# EasyEDA schematic Pendu_LED_Arrow.json
TITLE: Sheet_1; REV: 1.0; Date: 2024-11-20; Sheet: 1/1; Drawn By: AmirB; Company: Your Company
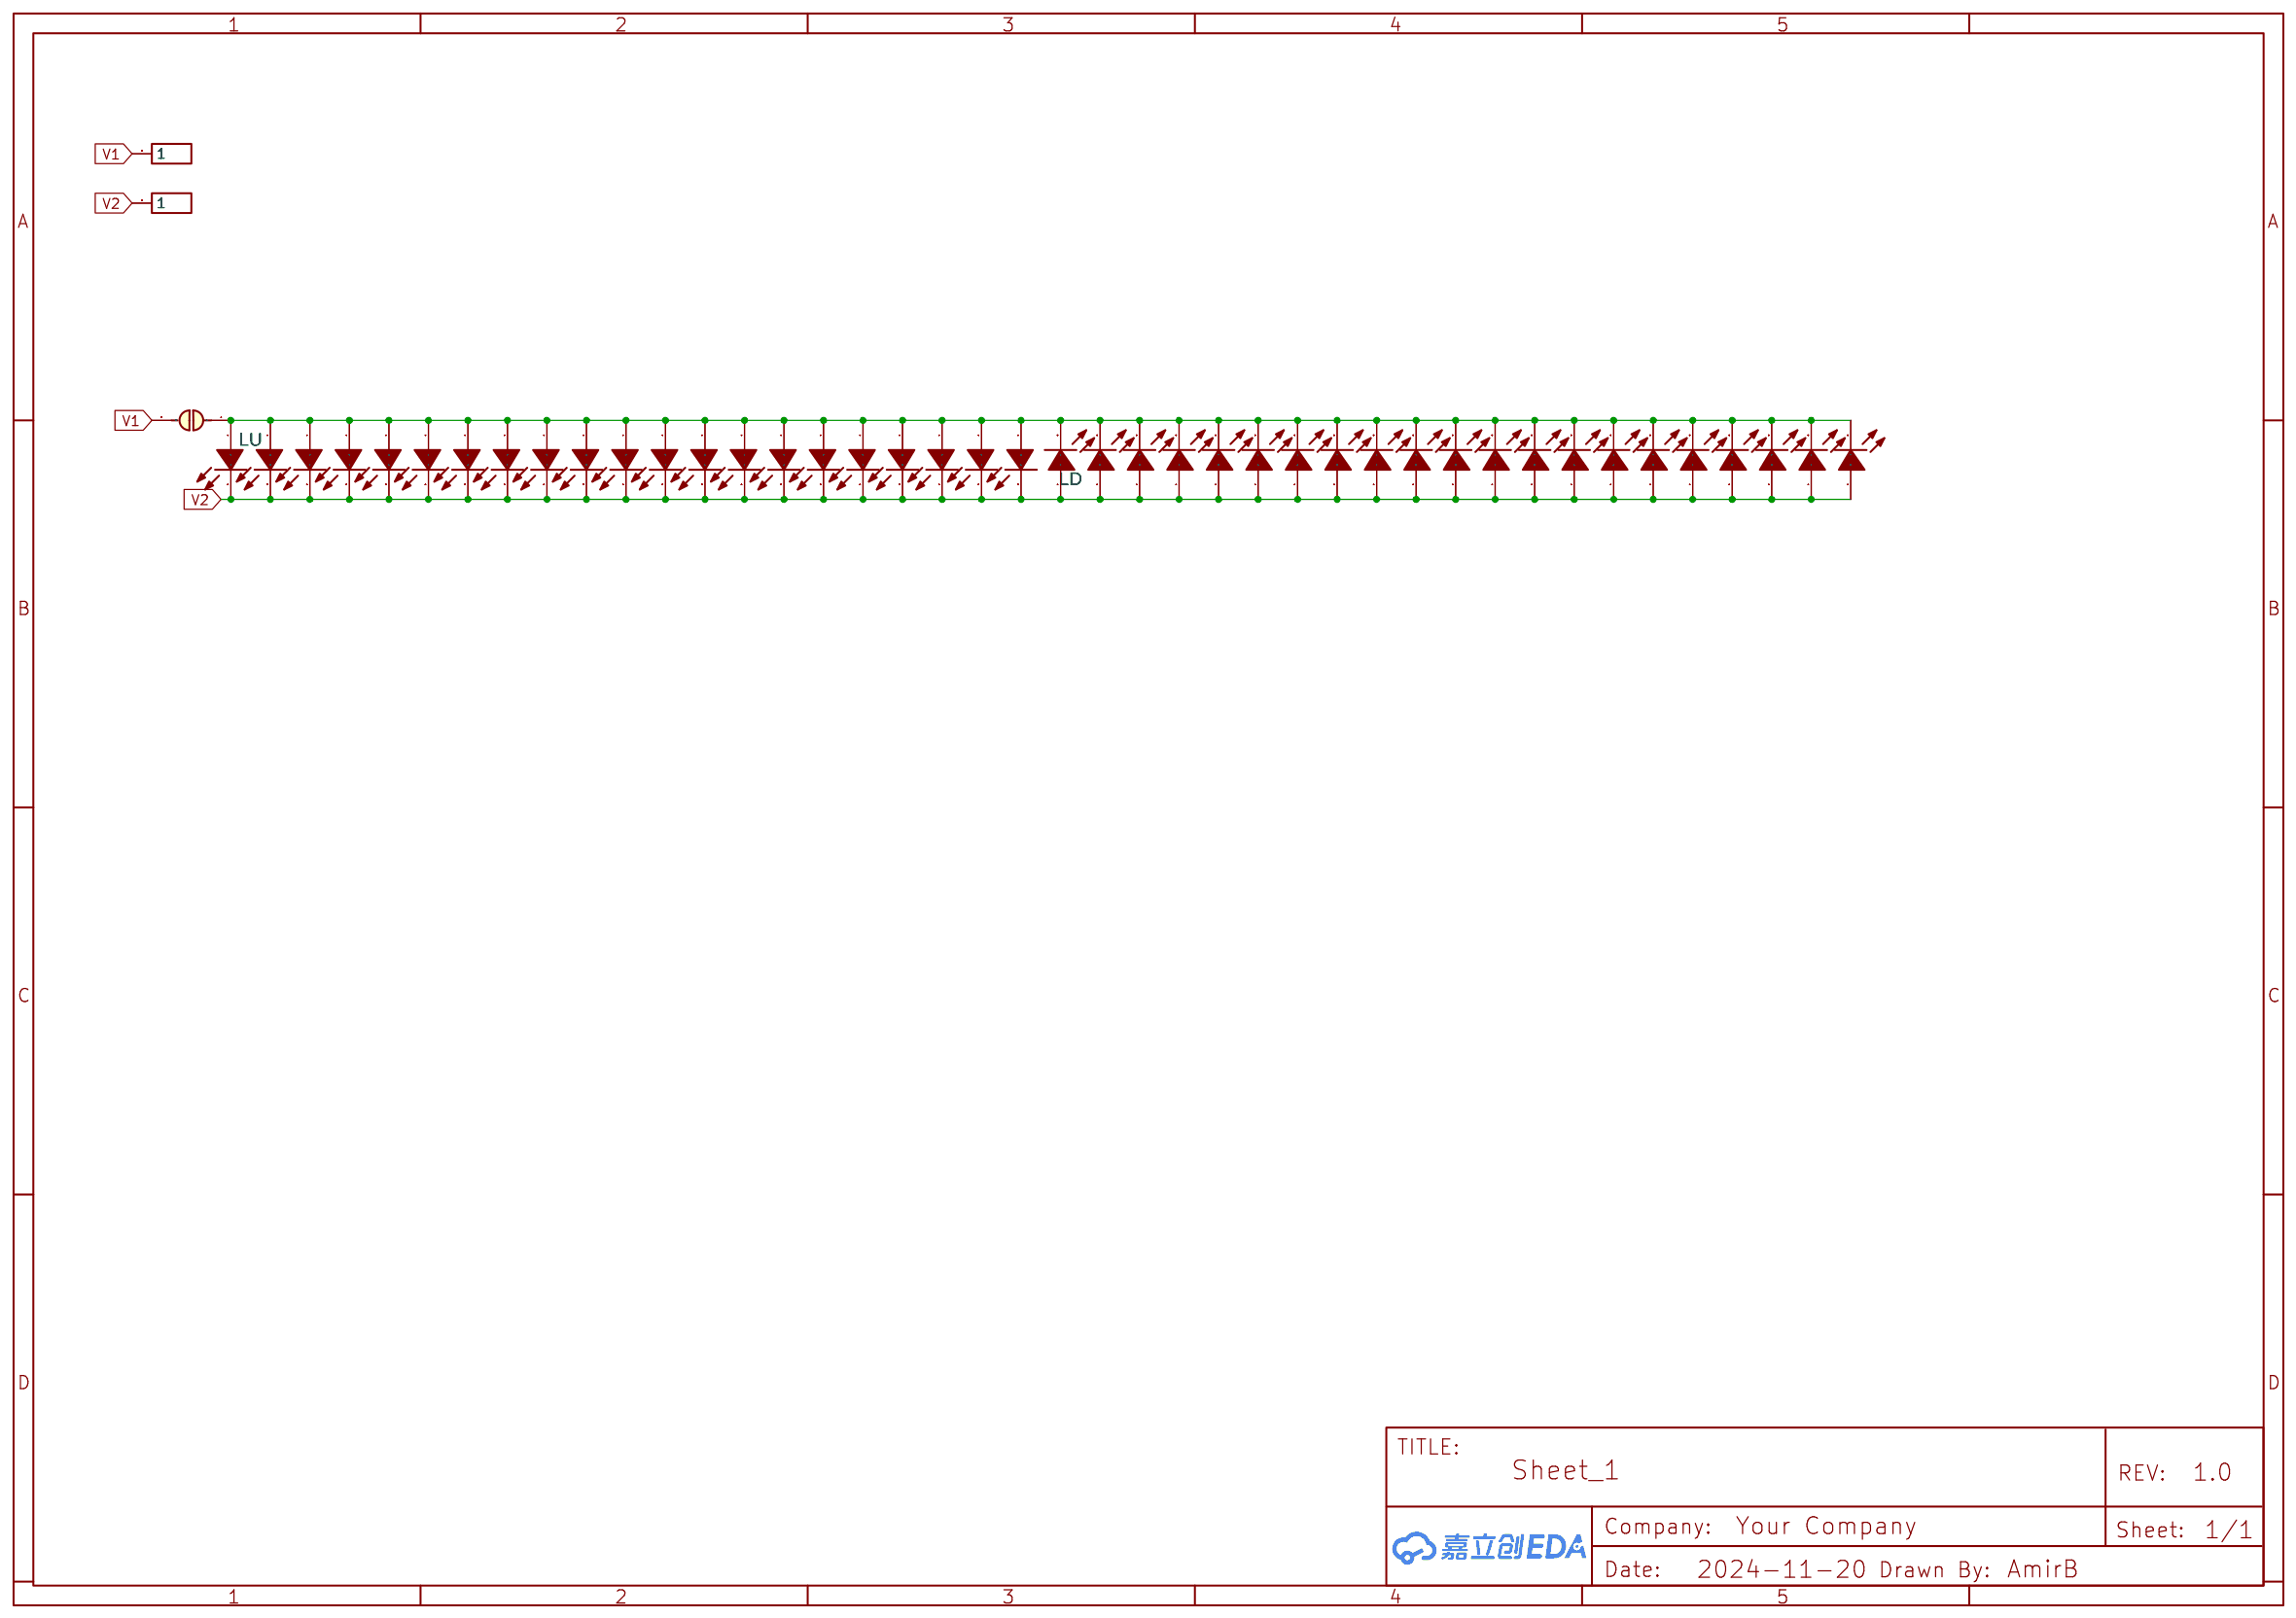
[diagram p0: schematic sheet]

## Parts
J1  HDR-M-2.54_1x1  [HDR-M-2.54_1X1]
J2  HDR-M-2.54_1x1  [HDR-M-2.54_1X1]
JU1  JUMPER-RESET  [JUMPERS_SMT-JUMPER_2_NC_PASTE_NO-SILK]
LD  FC-2012HRK-620D  [LED0805-R-RD]
LD1  FC-2012HRK-620D  [LED0805-R-RD]
LD2  FC-2012HRK-620D  [LED0805-R-RD]
LD3  FC-2012HRK-620D  [LED0805-R-RD]
LD4  FC-2012HRK-620D  [LED0805-R-RD]
LD5  FC-2012HRK-620D  [LED0805-R-RD]
LD6  FC-2012HRK-620D  [LED0805-R-RD]
LD7  FC-2012HRK-620D  [LED0805-R-RD]
LD8  FC-2012HRK-620D  [LED0805-R-RD]
LD9  FC-2012HRK-620D  [LED0805-R-RD]
LD10  FC-2012HRK-620D  [LED0805-R-RD]
LD11  FC-2012HRK-620D  [LED0805-R-RD]
LD12  FC-2012HRK-620D  [LED0805-R-RD]
LD13  FC-2012HRK-620D  [LED0805-R-RD]
LD14  FC-2012HRK-620D  [LED0805-R-RD]
LD15  FC-2012HRK-620D  [LED0805-R-RD]
LD16  FC-2012HRK-620D  [LED0805-R-RD]
LD17  FC-2012HRK-620D  [LED0805-R-RD]
LD18  FC-2012HRK-620D  [LED0805-R-RD]
LD19  FC-2012HRK-620D  [LED0805-R-RD]
LD20  FC-2012HRK-620D  [LED0805-R-RD]
LU  FC-2012HRK-620D  [LED0805-R-RD]
LU1  FC-2012HRK-620D  [LED0805-R-RD]
LU2  FC-2012HRK-620D  [LED0805-R-RD]
LU3  FC-2012HRK-620D  [LED0805-R-RD]
LU4  FC-2012HRK-620D  [LED0805-R-RD]
LU5  FC-2012HRK-620D  [LED0805-R-RD]
LU6  FC-2012HRK-620D  [LED0805-R-RD]
LU7  FC-2012HRK-620D  [LED0805-R-RD]
LU8  FC-2012HRK-620D  [LED0805-R-RD]
LU9  FC-2012HRK-620D  [LED0805-R-RD]
LU10  FC-2012HRK-620D  [LED0805-R-RD]
LU11  FC-2012HRK-620D  [LED0805-R-RD]
LU12  FC-2012HRK-620D  [LED0805-R-RD]
LU13  FC-2012HRK-620D  [LED0805-R-RD]
LU14  FC-2012HRK-620D  [LED0805-R-RD]
LU15  FC-2012HRK-620D  [LED0805-R-RD]
LU16  FC-2012HRK-620D  [LED0805-R-RD]
LU17  FC-2012HRK-620D  [LED0805-R-RD]
LU18  FC-2012HRK-620D  [LED0805-R-RD]
LU19  FC-2012HRK-620D  [LED0805-R-RD]
LU20  FC-2012HRK-620D  [LED0805-R-RD]

## Library data of the parts
J1 J2 = HDR-M-2.54_1x1: Supplier Part: C81276; Supplier: LCSC; Contributor: LCEDA_Lib; Package Display: No
JU1 = JUMPER-SMT_2: Contributor: P-Thomsen; Package Display: No
LD LD1-LD20 LU LU1-LU20 = FC-2012HRK-620D: JLCPCB Part Class: Basic Part; Package Display: No

## Nets
V1: J1.1 JU1.2
V2: J2.1 LD.1(+) LD1.1(+) LD2.1(+) LD3.1(+) LD4.1(+) LD5.1(+) LD6.1(+) LD7.1(+) LD8.1(+) LD9.1(+) LD10.1(+) LD11.1(+) LD12.1(+) LD13.1(+) LD14.1(+) LD15.1(+) LD16.1(+) LD17.1(+) LD18.1(+) LD19.1(+) LD20.1(+) LU.2(-) LU1.2(-) LU2.2(-) LU3.2(-) LU4.2(-) LU5.2(-) LU6.2(-) LU7.2(-) LU8.2(-) LU9.2(-) LU10.2(-) LU11.2(-) LU12.2(-) LU13.2(-) LU14.2(-) LU15.2(-) LU16.2(-) LU17.2(-) LU18.2(-) LU19.2(-) LU20.2(-)
Net-(JU1-1): JU1.1 LD.2(-) LD1.2(-) LD2.2(-) LD3.2(-) LD4.2(-) LD5.2(-) LD6.2(-) LD7.2(-) LD8.2(-) LD9.2(-) LD10.2(-) LD11.2(-) LD12.2(-) LD13.2(-) LD14.2(-) LD15.2(-) LD16.2(-) LD17.2(-) LD18.2(-) LD19.2(-) LD20.2(-) LU.1(+) LU1.1(+) LU2.1(+) LU3.1(+) LU4.1(+) LU5.1(+) LU6.1(+) LU7.1(+) LU8.1(+) LU9.1(+) LU10.1(+) LU11.1(+) LU12.1(+) LU13.1(+) LU14.1(+) LU15.1(+) LU16.1(+) LU17.1(+) LU18.1(+) LU19.1(+) LU20.1(+)
